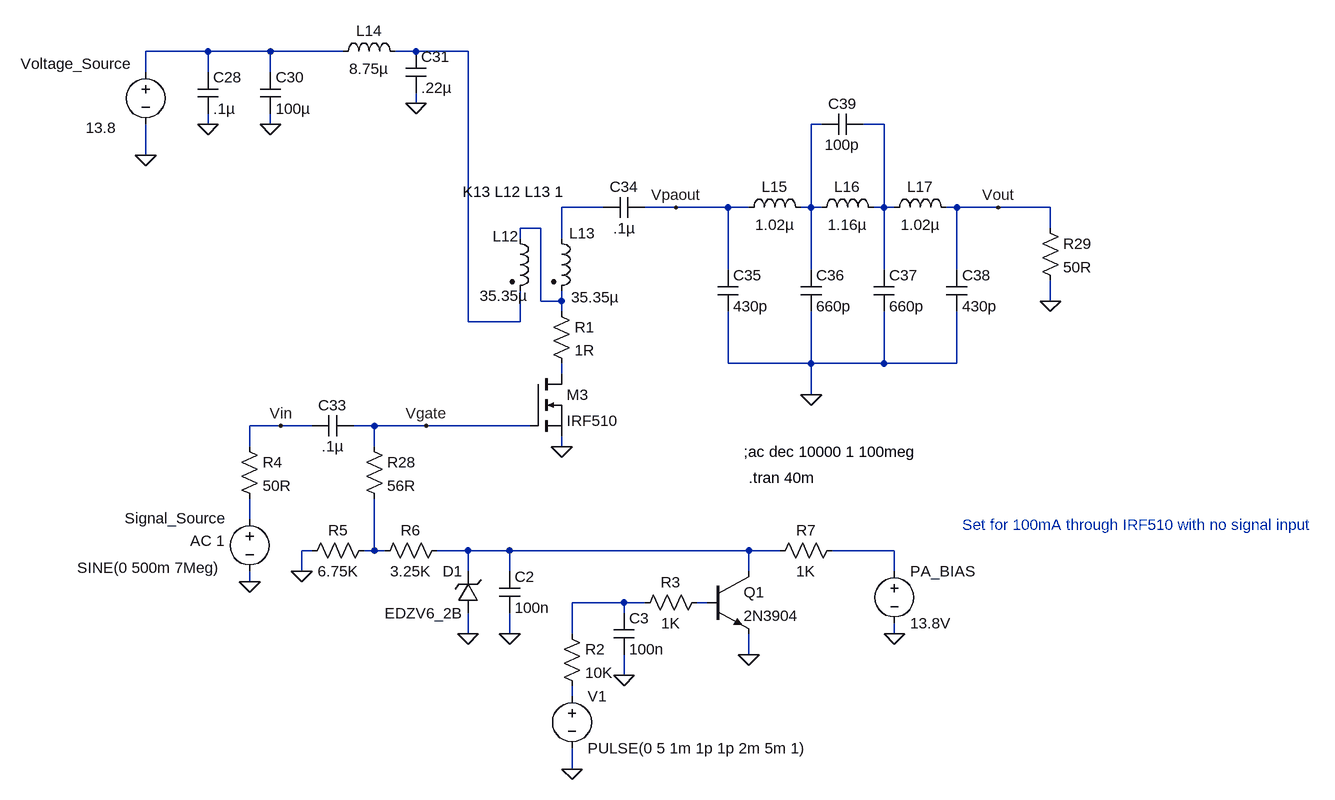
[diagram p0: schematic Raised Cosine Power Amp Testing.asc]
Raised Cosine Power Amp Testing.asc, the LTspice schematic file:
Version 4
SHEET 1 2548 2760
WIRE 336 1264 240 1264
WIRE 432 1264 336 1264
WIRE 544 1264 432 1264
WIRE 656 1264 624 1264
WIRE 736 1264 656 1264
WIRE 240 1296 240 1264
WIRE 336 1296 336 1264
WIRE 432 1296 432 1264
WIRE 656 1344 656 1328
WIRE 336 1376 336 1360
WIRE 432 1376 432 1360
WIRE 1280 1376 1264 1376
WIRE 1376 1376 1344 1376
WIRE 240 1424 240 1376
WIRE 944 1504 880 1504
WIRE 1056 1504 1008 1504
WIRE 1136 1504 1056 1504
WIRE 1168 1504 1136 1504
WIRE 1264 1504 1264 1376
WIRE 1264 1504 1248 1504
WIRE 1280 1504 1264 1504
WIRE 1376 1504 1376 1376
WIRE 1376 1504 1360 1504
WIRE 1392 1504 1376 1504
WIRE 1488 1504 1472 1504
WIRE 1552 1504 1488 1504
WIRE 1632 1504 1552 1504
WIRE 848 1536 816 1536
WIRE 1632 1536 1632 1504
WIRE 816 1552 816 1536
WIRE 880 1552 880 1504
WIRE 1136 1600 1136 1504
WIRE 1264 1600 1264 1504
WIRE 1376 1600 1376 1504
WIRE 1488 1600 1488 1504
WIRE 848 1648 848 1536
WIRE 880 1648 880 1632
WIRE 880 1648 848 1648
WIRE 1632 1648 1632 1616
WIRE 880 1664 880 1648
WIRE 736 1680 736 1264
WIRE 816 1680 816 1632
WIRE 816 1680 736 1680
WIRE 1136 1744 1136 1664
WIRE 1264 1744 1264 1664
WIRE 1264 1744 1136 1744
WIRE 1376 1744 1376 1664
WIRE 1376 1744 1264 1744
WIRE 1488 1744 1488 1664
WIRE 1488 1744 1376 1744
WIRE 880 1760 880 1744
WIRE 1264 1792 1264 1744
WIRE 448 1840 400 1840
WIRE 496 1840 448 1840
WIRE 592 1840 560 1840
WIRE 672 1840 592 1840
WIRE 832 1840 672 1840
WIRE 400 1872 400 1840
WIRE 592 1872 592 1840
WIRE 880 1872 880 1856
WIRE 400 1984 400 1952
WIRE 496 2032 480 2032
WIRE 592 2032 592 1952
WIRE 592 2032 576 2032
WIRE 608 2032 592 2032
WIRE 736 2032 688 2032
WIRE 800 2032 736 2032
WIRE 1168 2032 800 2032
WIRE 1216 2032 1168 2032
WIRE 1392 2032 1296 2032
WIRE 480 2064 480 2032
WIRE 736 2064 736 2032
WIRE 800 2064 800 2032
WIRE 1168 2064 1168 2032
WIRE 1392 2064 1392 2032
WIRE 400 2080 400 2064
WIRE 976 2112 896 2112
WIRE 1008 2112 976 2112
WIRE 1104 2112 1088 2112
WIRE 976 2128 976 2112
WIRE 736 2160 736 2128
WIRE 800 2160 800 2128
WIRE 896 2160 896 2112
WIRE 1392 2160 1392 2144
WIRE 1168 2192 1168 2160
WIRE 976 2224 976 2192
WIRE 896 2256 896 2240
WIRE 896 2368 896 2336
FLAG 400 2080 0
FLAG 240 1424 0
FLAG 336 1376 0
FLAG 432 1376 0
FLAG 656 1344 0
FLAG 1632 1648 0
FLAG 880 1872 0
FLAG 1056 1504 Vpaout
FLAG 448 1840 Vin
FLAG 672 1840 Vgate
FLAG 1264 1792 0
FLAG 1552 1504 Vout
FLAG 480 2064 0
FLAG 800 2160 0
FLAG 736 2160 0
FLAG 1392 2160 0
FLAG 1168 2192 0
FLAG 896 2368 0
FLAG 976 2224 0
SYMBOL voltage 400 1968 R0
WINDOW 3 -265 90 Left 2
WINDOW 123 -91 49 Left 2
WINDOW 0 -192 14 Left 2
WINDOW 39 0 0 Left 2
SYMATTR Value SINE(0 500m 7Meg)
SYMATTR Value2 AC 1
SYMATTR InstName Signal_Source
SYMBOL res 384 1856 R0
SYMATTR InstName R4
SYMATTR Value 50R
SYMBOL nmos 832 1760 R0
SYMATTR InstName M3
SYMATTR Value IRF510
SYMBOL voltage 240 1280 R0
WINDOW 123 0 0 Left 2
WINDOW 39 0 0 Left 2
WINDOW 0 -192 3 Left 2
WINDOW 3 -92 101 Left 2
SYMATTR InstName Voltage_Source
SYMATTR Value 13.8
SYMBOL cap 320 1296 R0
SYMATTR InstName C28
SYMATTR Value .1µ
SYMBOL ind2 800 1536 R0
WINDOW 0 -26 12 Left 2
WINDOW 3 -46 104 Left 2
SYMATTR InstName L12
SYMATTR Value 35.35µ
SYMATTR Type ind
SYMBOL ind2 864 1536 R0
WINDOW 0 28 8 Left 2
WINDOW 3 31 106 Left 2
SYMATTR InstName L13
SYMATTR Value 35.35µ
SYMATTR Type ind
SYMBOL ind 528 1280 R270
WINDOW 0 32 56 VTop 2
WINDOW 3 5 56 VBottom 2
SYMATTR InstName L14
SYMATTR Value 8.75µ
SYMBOL cap 416 1296 R0
SYMATTR InstName C30
SYMATTR Value 100µ
SYMBOL cap 640 1264 R0
SYMATTR InstName C31
SYMATTR Value .22µ
SYMBOL res 576 1856 R0
SYMATTR InstName R28
SYMATTR Value 56R
SYMBOL voltage 1392 2048 R0
WINDOW 123 0 0 Left 2
WINDOW 39 0 0 Left 2
SYMATTR InstName PA_BIAS
SYMATTR Value 13.8V
SYMBOL cap 560 1824 R90
WINDOW 0 0 32 VBottom 2
WINDOW 3 32 32 VTop 2
SYMATTR InstName C33
SYMATTR Value .1µ
SYMBOL cap 1008 1488 R90
WINDOW 0 0 32 VBottom 2
WINDOW 3 32 32 VTop 2
SYMATTR InstName C34
SYMATTR Value .1µ
SYMBOL res 1616 1520 R0
SYMATTR InstName R29
SYMATTR Value 50R
SYMBOL ind 1152 1520 R270
WINDOW 0 32 56 VTop 2
WINDOW 3 5 56 VBottom 2
SYMATTR InstName L15
SYMATTR Value 1.02µ
SYMBOL ind 1264 1520 R270
WINDOW 0 32 56 VTop 2
WINDOW 3 5 56 VBottom 2
SYMATTR InstName L16
SYMATTR Value 1.16µ
SYMBOL ind 1376 1520 R270
WINDOW 0 32 56 VTop 2
WINDOW 3 5 56 VBottom 2
SYMATTR InstName L17
SYMATTR Value 1.02µ
SYMBOL cap 1120 1600 R0
SYMATTR InstName C35
SYMATTR Value 430p
SYMBOL cap 1248 1600 R0
SYMATTR InstName C36
SYMATTR Value 660p
SYMBOL cap 1360 1600 R0
SYMATTR InstName C37
SYMATTR Value 660p
SYMBOL cap 1472 1600 R0
SYMATTR InstName C38
SYMATTR Value 430p
SYMBOL cap 1344 1360 R90
WINDOW 0 0 32 VBottom 2
WINDOW 3 32 32 VTop 2
SYMATTR InstName C39
SYMATTR Value 100p
SYMBOL res 864 1648 R0
SYMATTR InstName R1
SYMATTR Value 1R
SYMBOL res 592 2016 R90
WINDOW 0 0 56 VBottom 2
WINDOW 3 32 56 VTop 2
SYMATTR InstName R5
SYMATTR Value 6.75K
SYMBOL res 704 2016 R90
WINDOW 0 0 56 VBottom 2
WINDOW 3 32 56 VTop 2
SYMATTR InstName R6
SYMATTR Value 3.25K
SYMBOL zener 752 2128 R180
WINDOW 0 24 64 Left 2
WINDOW 3 24 0 Left 2
SYMATTR InstName D1
SYMATTR Value EDZV6_2B
SYMATTR Description Diode
SYMATTR Type diode
SYMBOL res 1312 2016 R90
WINDOW 0 0 56 VBottom 2
WINDOW 3 32 56 VTop 2
SYMATTR InstName R7
SYMATTR Value 1K
SYMBOL cap 784 2064 R0
SYMATTR InstName C2
SYMATTR Value 100n
SYMBOL npn 1104 2064 R0
SYMATTR InstName Q1
SYMATTR Value 2N3904
SYMBOL res 880 2144 R0
SYMATTR InstName R2
SYMATTR Value 10K
SYMBOL voltage 896 2240 R0
WINDOW 123 0 0 Left 2
WINDOW 39 0 0 Left 2
SYMATTR InstName V1
SYMATTR Value PULSE(0 5 1m 1p 1p 2m 5m 1)
SYMBOL cap 960 2128 R0
SYMATTR InstName C3
SYMATTR Value 100n
SYMBOL res 1104 2096 R90
WINDOW 0 0 56 VBottom 2
WINDOW 3 32 56 VTop 2
SYMATTR InstName R3
SYMATTR Value 1K
TEXT 1168 1920 Left 2 !.tran 40m
TEXT 728 1480 Left 2 !K13 L12 L13 1
TEXT 1496 1992 Left 2 ;Set for 100mA through IRF510 with no signal input
TEXT 1160 1880 Left 2 !;ac dec 10000 1 100meg

The netlist it stands for:
* Raised Cosine Power Amp Testing.asc
V§Signal_Source N008 0 SINE(0 500m 7Meg) AC 1
R4 Vin N008 50R
M3 N007 Vgate 0 0 IRF510
Voltage_Source N001 0 13.8
C28 N001 0 .1µ
L12 N006 N002 35.35µ
L13 N005 N006 35.35µ
L14 N001 N002 8.75µ
C30 N001 0 100µ
C31 N002 0 .22µ
R28 Vgate N009 56R
V§PA_BIAS N011 0 13.8V
C33 Vgate Vin .1µ
C34 Vpaout N005 .1µ
R29 Vout 0 50R
L15 Vpaout N003 1.02µ
L16 N003 N004 1.16µ
L17 N004 Vout 1.02µ
C35 Vpaout 0 430p
C36 N003 0 660p
C37 N004 0 660p
C38 Vout 0 430p
C39 N004 N003 100p
R1 N006 N007 1R
R5 N009 0 6.75K
R6 N010 N009 3.25K
D1 0 N010 EDZV6_2B
R7 N011 N010 1K
C2 N010 0 100n
Q1 N010 N013 0 0 2N3904
R2 N012 N014 10K
V1 N014 0 PULSE(0 5 1m 1p 1p 2m 5m 1)
C3 N012 0 100n
R3 N013 N012 1K
.model D D
.lib standard.dio
.model NPN NPN
.model PNP PNP
.lib standard.bjt
.model NMOS NMOS
.model PMOS PMOS
.lib standard.mos
.tran 40m
K13 L12 L13 1
* Set for 100mA through IRF510 with no signal input
;ac dec 10000 1 100meg
.backanno
.end